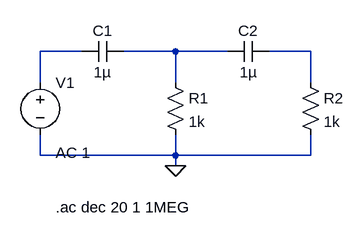
[diagram p0: schematic second-order-high-pass-RC-filter.asc]
second-order-high-pass-RC-filter.asc, the LTspice schematic file:
Version 4
SHEET 1 880 680
WIRE 160 80 96 80
WIRE 304 80 224 80
WIRE 384 80 304 80
WIRE 512 80 448 80
WIRE 96 128 96 80
WIRE 304 128 304 80
WIRE 512 128 512 80
WIRE 96 240 96 208
WIRE 304 240 304 208
WIRE 304 240 96 240
WIRE 512 240 512 208
WIRE 512 240 304 240
WIRE 304 256 304 240
FLAG 304 256 0
SYMBOL res 288 112 R0
SYMATTR InstName R1
SYMATTR Value 1k
SYMBOL cap 224 64 R90
WINDOW 0 0 32 VBottom 2
WINDOW 3 32 32 VTop 2
SYMATTR InstName C1
SYMATTR Value 1µ
SYMBOL voltage 96 112 R0
WINDOW 123 24 124 Left 2
WINDOW 39 0 0 Left 2
SYMATTR Value2 AC 1
SYMATTR InstName V1
SYMATTR Value ""
SYMBOL cap 448 64 R90
WINDOW 0 0 32 VBottom 2
WINDOW 3 32 32 VTop 2
SYMATTR InstName C2
SYMATTR Value 1µ
SYMBOL res 496 112 R0
SYMATTR InstName R2
SYMATTR Value 1k
TEXT 120 320 Left 2 !.ac dec 20 1 1MEG

The netlist it stands for:
* second-order-high-pass-RC-filter.asc
R1 N002 0 1k
C1 N002 N001 1µ
V1 N001 0 AC 1
C2 N003 N002 1µ
R2 N003 0 1k
.ac dec 20 1 1MEG
.backanno
.end